# Altium project ST1-1.PrjPcb (part 4 of 5)

## Sheet Measurement.SchDoc: Measurement
size A3; DocumentNumber: 11; SheetNumber: 11; SheetTotal: 19
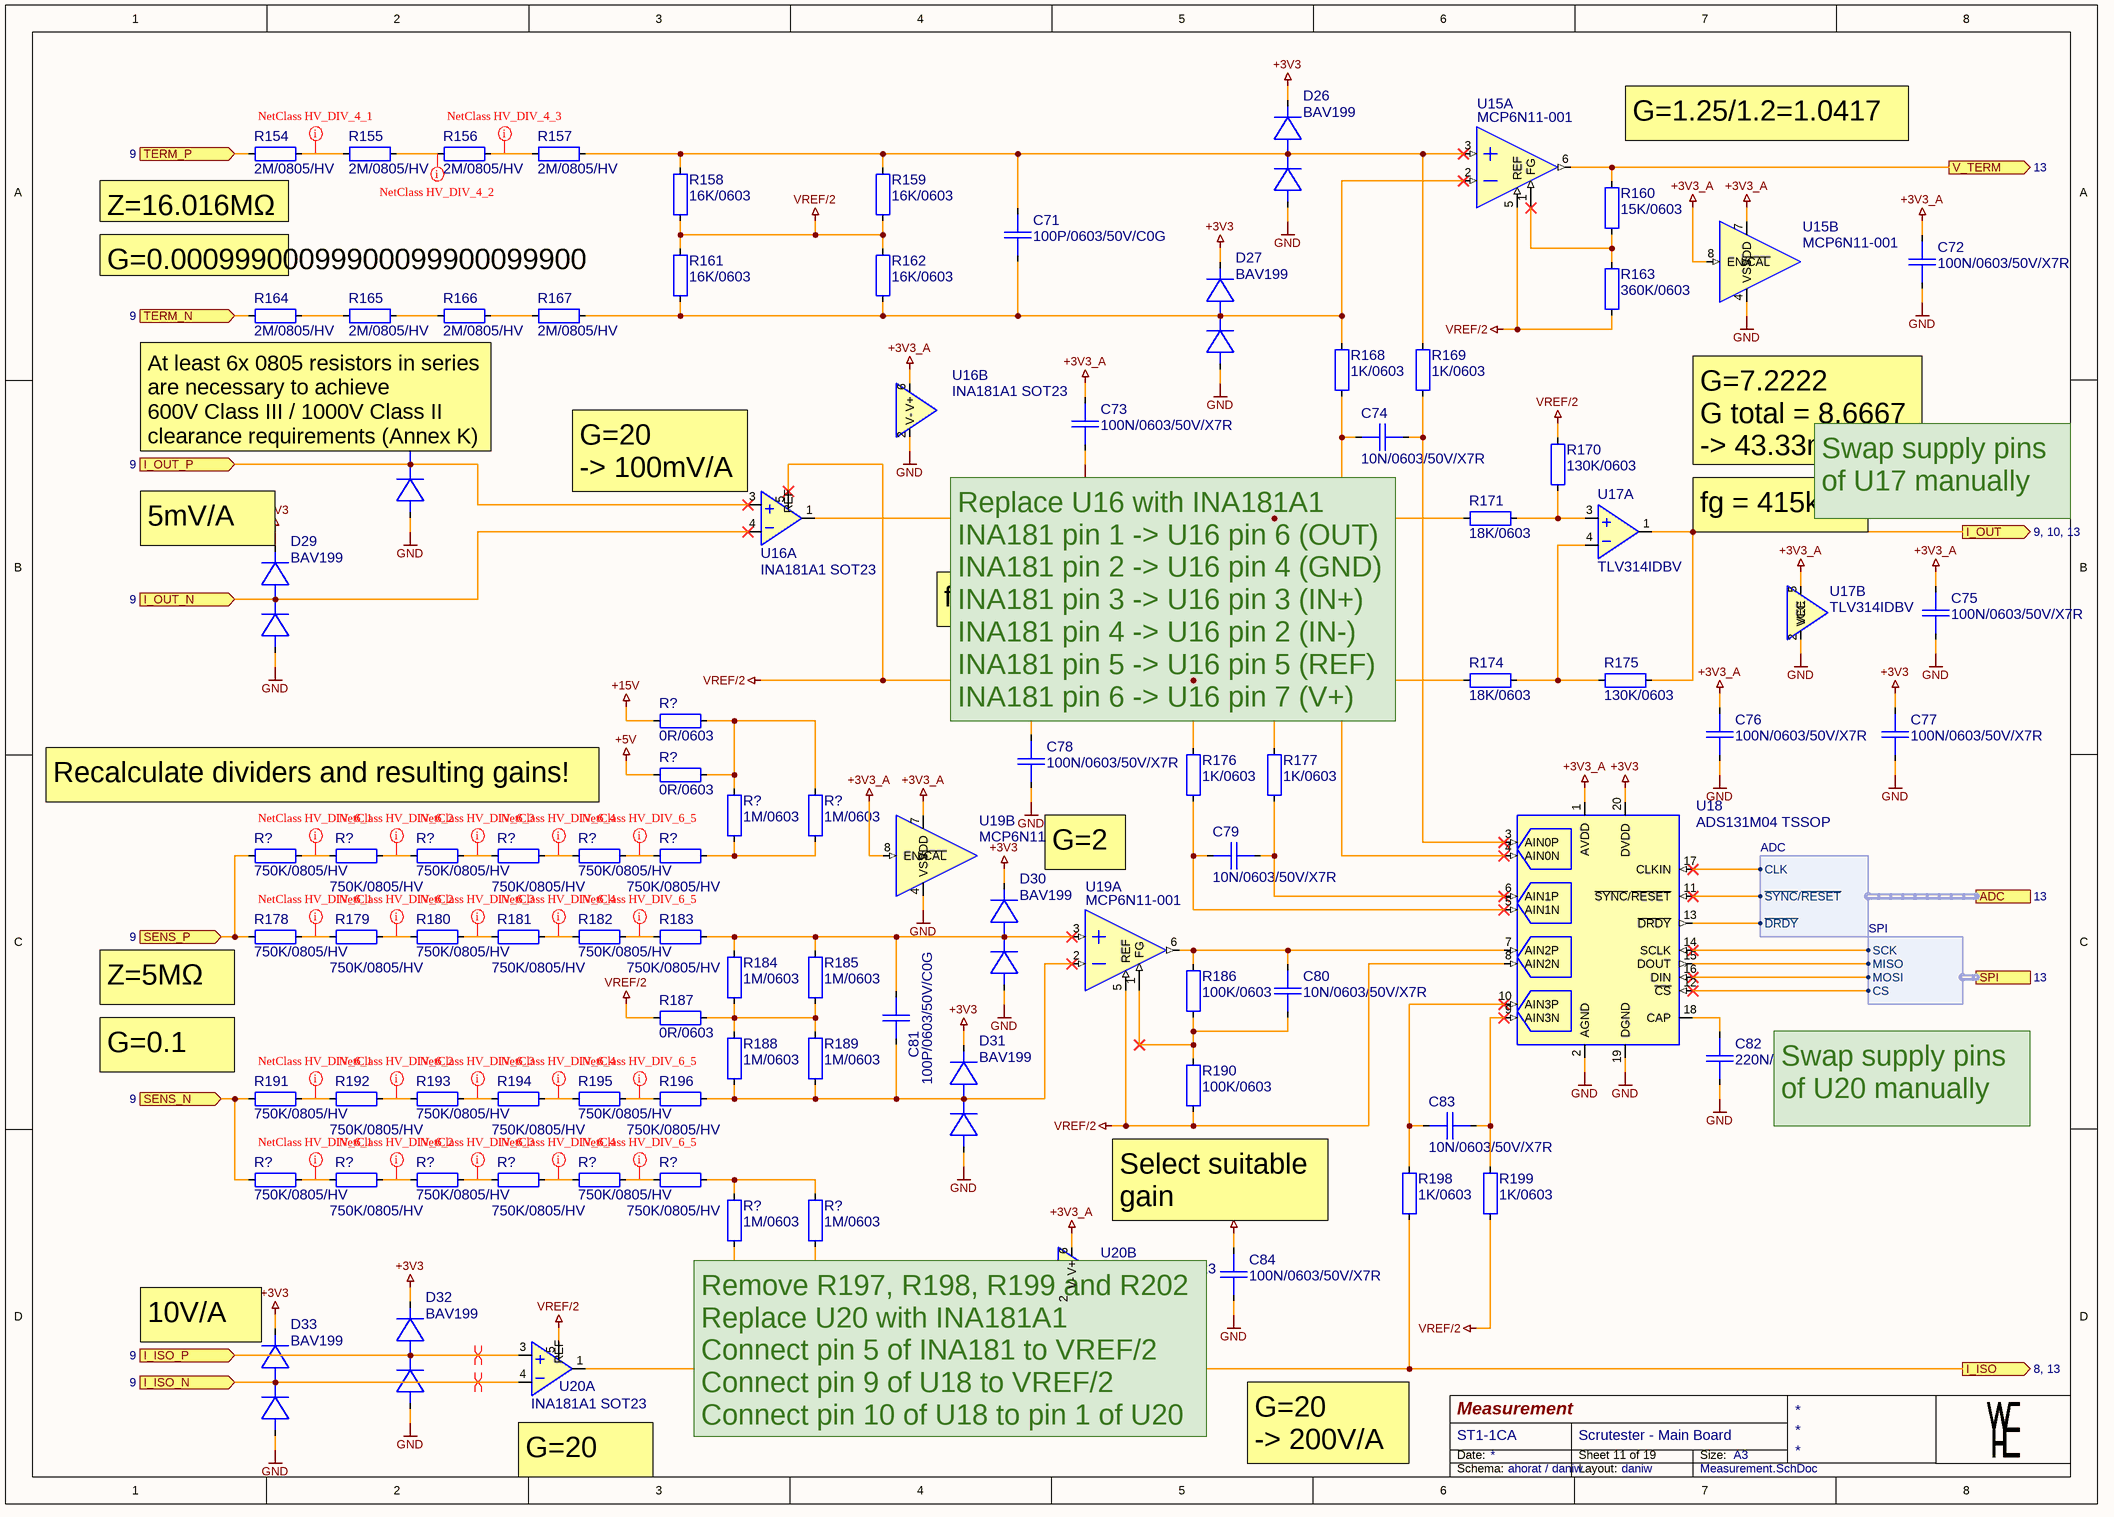
[diagram p8: Measurement.SchDoc]

### Parts
(Parts that share a designator on the sheet are numbered #1, #2 ... from top to bottom, then left to right.)
C71  100P/0603/50V/C0G  [CAP0603_C0G]
C72  100N/0603/50V/X7R  [CAP0603_X7R]
C73  100N/0603/50V/X7R  [CAP0603_X7R]
C74  10N/0603/50V/X7R  [CAP0603_X7R]
C75  100N/0603/50V/X7R  [CAP0603_X7R]
C76  100N/0603/50V/X7R  [CAP0603_X7R]
C77  100N/0603/50V/X7R  [CAP0603_X7R]
C78  100N/0603/50V/X7R  [CAP0603_X7R]
C79  10N/0603/50V/X7R  [CAP0603_X7R]
C80  10N/0603/50V/X7R  [CAP0603_X7R]
C81  100P/0603/50V/C0G  [CAP0603_C0G]
C82  220N/0603/25V/X7R  [CAP0603_X7R]
C83  10N/0603/50V/X7R  [CAP0603_X7R]
C84  100N/0603/50V/X7R  [CAP0603_X7R]
D26  BAV199  [SOT2395P280X125-3-SE]
D27  BAV199  [SOT2395P280X125-3-SE]
D28  BAV199  [SOT2395P280X125-3-SE]
D29  BAV199  [SOT2395P280X125-3-SE]
D30  BAV199  [SOT2395P280X125-3-SE]
D31  BAV199  [SOT2395P280X125-3-SE]
D32  BAV199  [SOT2395P280X125-3-SE]
D33  BAV199  [SOT2395P280X125-3-SE]
R154  2M/0805/HV  [R0805-0.50-HV-WW]
R155  2M/0805/HV  [R0805-0.50-HV-WW]
R156  2M/0805/HV  [R0805-0.50-HV-WW]
R157  2M/0805/HV  [R0805-0.50-HV-WW]
R158  16K/0603  [R0603-0.40-WW]
R159  16K/0603  [R0603-0.40-WW]
R160  15K/0603  [R0603-0.40-WW]
R161  16K/0603  [R0603-0.40-WW]
R162  16K/0603  [R0603-0.40-WW]
R163  360K/0603  [R0603-0.40-WW]
R164  2M/0805/HV  [R0805-0.50-HV-WW]
R165  2M/0805/HV  [R0805-0.50-HV-WW]
R166  2M/0805/HV  [R0805-0.50-HV-WW]
R167  2M/0805/HV  [R0805-0.50-HV-WW]
R168  1K/0603  [R0603-0.40-WW]
R169  1K/0603  [R0603-0.40-WW]
R170  130K/0603  [R0603-0.40-WW]
R171  18K/0603  [R0603-0.40-WW]
R174  18K/0603  [R0603-0.40-WW]
R175  130K/0603  [R0603-0.40-WW]
R176  1K/0603  [R0603-0.40-WW]
R177  1K/0603  [R0603-0.40-WW]
R178  750K/0805/HV  [R0805-0.50-HV-WW]
R179  750K/0805/HV  [R0805-0.50-HV-WW]
R180  750K/0805/HV  [R0805-0.50-HV-WW]
R181  750K/0805/HV  [R0805-0.50-HV-WW]
R182  750K/0805/HV  [R0805-0.50-HV-WW]
R183  750K/0805/HV  [R0805-0.50-HV-WW]
R184  1M/0603  [R0603-0.40-WW]
R185  1M/0603  [R0603-0.40-WW]
R186  100K/0603  [R0603-0.40-WW]
R187  0R/0603  [R0603-0.40-WW]
R188  1M/0603  [R0603-0.40-WW]
R189  1M/0603  [R0603-0.40-WW]
R190  100K/0603  [R0603-0.40-WW]
R191  750K/0805/HV  [R0805-0.50-HV-WW]
R192  750K/0805/HV  [R0805-0.50-HV-WW]
R193  750K/0805/HV  [R0805-0.50-HV-WW]
R194  750K/0805/HV  [R0805-0.50-HV-WW]
R195  750K/0805/HV  [R0805-0.50-HV-WW]
R196  750K/0805/HV  [R0805-0.50-HV-WW]
R198  1K/0603  [R0603-0.40-WW]
R199  1K/0603  [R0603-0.40-WW]
R?#11  0R/0603  [R0603-0.40-WW]
R?#12  0R/0603  [R0603-0.40-WW]
R?#13  1M/0603  [R0603-0.40-WW]
R?#14  1M/0603  [R0603-0.40-WW]
R?#15  750K/0805/HV  [R0805-0.50-HV-WW]
R?#16  750K/0805/HV  [R0805-0.50-HV-WW]
R?#17  750K/0805/HV  [R0805-0.50-HV-WW]
R?#18  750K/0805/HV  [R0805-0.50-HV-WW]
R?#19  750K/0805/HV  [R0805-0.50-HV-WW]
R?#20  750K/0805/HV  [R0805-0.50-HV-WW]
R?#21  750K/0805/HV  [R0805-0.50-HV-WW]
R?#22  750K/0805/HV  [R0805-0.50-HV-WW]
R?#23  750K/0805/HV  [R0805-0.50-HV-WW]
R?#24  750K/0805/HV  [R0805-0.50-HV-WW]
R?#25  750K/0805/HV  [R0805-0.50-HV-WW]
R?#26  750K/0805/HV  [R0805-0.50-HV-WW]
R?#27  1M/0603  [R0603-0.40-WW]
R?#28  1M/0603  [R0603-0.40-WW]
U15  MCP6N11-001  [SOP127P600X155-8-SW]  (parts A,B of 2)
U16  INA181A1 SOT23  [SOT2395P280X125-6-SE]  (parts A,B of 2)
U17  TLV314IDBV  [SOT2395P280X125-5-NW]  (parts A,B of 2)
U18  ADS131M04 TSSOP  [SOP065P640X120-20NW]
U19  MCP6N11-001  [SOP127P600X155-8-SW]  (parts A,B of 2)
U20  INA181A1 SOT23  [SOT2395P280X125-6-SE]  (parts A,B of 2)

### Ports
ADC (harness ADC, see 13), I_ISO (out, see 8, 13), I_ISO_N (in, see 9), I_ISO_P (in, see 9), I_OUT (out, see 9, 10, 13), I_OUT_N (in, see 9), I_OUT_P (in, see 9), SENS_N (in, see 9), SENS_P (in, see 9), SPI (harness SPI, see 13), TERM_N (in, see 9), TERM_P (in, see 9), V_TERM (out, see 13)

### Harnesses
ADC: CLK, ~{SYNC}/~{RESET}, ~{DRDY}
SPI: SCK, MISO, MOSI, CS

### Nets
+3V3: C77.1 D26.2(K2) D27.2(K2) D28.2(K2) D29.2(K2) D30.2(K2) D31.2(K2) D32.2(K2) D33.2(K2) U18.20(DVDD)
+3V3_A: C72.1 C73.1 C75.1 C76.1 C78.1 C84.1 U15.7(VDD) U15.8(EN/~{CAL}) U16.6(V+) U17.5(VCC) U18.1(AVDD) U19.7(VDD) U19.8(EN/~{CAL}) U20.6(V+)
+5V: R?#12.2
+15V: R?#11.2
GND: C72.2 C73.2 C75.2 C76.2 C77.2 C78.2 C82.2 C84.2 D26.1(A1) D27.1(A1) D28.1(A1) D29.1(A1) D30.1(A1) D31.1(A1) D32.1(A1) D33.1(A1) R?#27.2 R?#28.2 U15.4(VSS) U16.2(V-) U17.2(VEE) U18.2(AGND) U18.19(DGND) U19.4(VSS) U20.2(V-)
VREF/2: R158.2 R159.2 R161.1 R162.1 R163.2 R170.2 R174.1 R176.1 R187.2 R190.2 R199.2 U15.5(REF) U16.5(REF) U18.8(AIN2N) U19.5(REF) U20.5(REF)
ADC.CLK: U18.17(CLKIN) ; port ADC.CLK
ADC.~{DRDY}: U18.13(~{DRDY}) ; port ADC.~{DRDY}
ADC.~{SYNC}/~{RESET}: U18.11(~{SYNC}/~{RESET}) ; port ADC.~{SYNC}/~{RESET}
I_ISO: R198.2 U20.1(OUT) ; port I_ISO
I_ISO_N: D33.3(K1/A2) U20.4(IN-) ; port I_ISO_N
I_ISO_P: D32.3(K1/A2) U20.3(IN+) ; port I_ISO_P
I_OUT: R175.2 U17.1(OUT) ; port I_OUT
I_OUT_N: D29.3(K1/A2) U16.4(IN-) ; port I_OUT_N
I_OUT_P: D28.3(K1/A2) U16.3(IN+) ; port I_OUT_P
SENS_N: R191.1 R?#21.1 ; port SENS_N
SENS_P: R178.1 R?#15.1 ; port SENS_P
SPI.CS: U18.12(~{CS}) ; port SPI.CS
SPI.MISO: U18.15(DOUT) ; port SPI.MISO
SPI.MOSI: U18.16(DIN) ; port SPI.MOSI
SPI.SCK: U18.14(SCLK) ; port SPI.SCK
TERM_N: R164.1 ; port TERM_N
TERM_P: R154.1 ; port TERM_P
V_TERM: R160.1 U15.6(Out) ; port V_TERM
NetC71_1: C71.1 D26.3(K1/A2) R157.1 R158.1 R159.1 R169.1 U15.3(+)
NetC71_2: C71.2 D27.3(K1/A2) R161.2 R162.2 R167.2 R168.1 U15.2(-)
NetC74_1: C74.1 R168.2 U18.4(AIN0N)
NetC74_2: C74.2 R169.2 U18.3(AIN0P)
NetC79_1: C79.1 R176.2 U18.5(AIN1N)
NetC79_2: C79.2 R177.2 U18.6(AIN1P)
NetC80_1: C80.1 R186.1 U18.7(AIN2P) U19.6(Out)
NetC80_2: C80.2 R186.2 R190.1 U19.1(FG)
NetC81_1: C81.1 D30.3(K1/A2) R183.2 R184.1 R185.1 U19.3(+)
NetC81_2: C81.2 D31.3(K1/A2) R188.2 R189.2 R196.2 U19.2(-)
NetC82_1: C82.1 U18.18(CAP)
NetC83_1: C83.1 R198.1 U18.10(AIN3P)
NetC83_2: C83.2 R199.1 U18.9(AIN3N)
NetR154_2: R154.2 R155.2
NetR155_1: R155.1 R156.1
NetR156_2: R156.2 R157.2
NetR160_2: R160.2 R163.1 U15.1(FG)
NetR164_2: R164.2 R165.1
NetR165_2: R165.2 R166.1
NetR166_2: R166.2 R167.1
NetR170_1: R170.1 R171.2 U17.3(IN+)
NetR171_1: R171.1 R177.1 U16.1(OUT)
NetR174_2: R174.2 R175.1 U17.4(IN-)
NetR178_2: R178.2 R179.1
NetR179_2: R179.2 R180.1
NetR180_2: R180.2 R181.1
NetR181_2: R181.2 R182.1
NetR182_2: R182.2 R183.1
NetR184_2: R184.2 R185.2 R187.1 R188.1 R189.1
NetR191_2: R191.2 R192.1
NetR192_2: R192.2 R193.1
NetR193_2: R193.2 R194.1
NetR194_2: R194.2 R195.1
NetR195_2: R195.2 R196.1
NetR?#11_1: R?#11.1 R?#12.1 R?#13.1 R?#14.1
NetR?#13_2: R?#13.2 R?#14.2 R?#20.2
NetR?#15_2: R?#15.2 R?#16.1
NetR?#16_2: R?#16.2 R?#17.1
NetR?#17_2: R?#17.2 R?#18.1
NetR?#18_2: R?#18.2 R?#19.1
NetR?#19_2: R?#19.2 R?#20.1
NetR?#21_2: R?#21.2 R?#22.1
NetR?#22_2: R?#22.2 R?#23.1
NetR?#23_2: R?#23.2 R?#24.1
NetR?#24_2: R?#24.2 R?#25.1
NetR?#25_2: R?#25.2 R?#26.1
NetR?#26_2: R?#26.2 R?#27.1 R?#28.1

### Layout directives
net class HV_DIV_4_1: NetR154_2
net class HV_DIV_4_2: NetR155_1
net class HV_DIV_4_3: NetR156_2
net class HV_DIV_6_1: NetR178_2, NetR191_2, NetR?#15_2, NetR?#21_2
net class HV_DIV_6_2: NetR179_2, NetR192_2, NetR?#16_2, NetR?#22_2
net class HV_DIV_6_3: NetR180_2, NetR193_2, NetR?#17_2, NetR?#23_2
differential pair: I_ISO_N, I_ISO_P
net class HV_DIV_6_4: NetR181_2, NetR194_2, NetR?#18_2, NetR?#24_2
net class HV_DIV_6_5: NetR182_2, NetR195_2, NetR?#19_2, NetR?#25_2

### Notes on the sheet
- G=1.25/1.2=1.0417
- (near R154) Z=16.016MΩ
- (near R164) G=0.00099900099900099900099900
- (near D28) At least 6x 0805 resistors in series are necessary to achieve
  600V Class III / 1000V Class II clearance requirements (Annex K)
- (near U16) G=20
  -> 100mV/A
- G=7.2222
  G total = 8.6667
  -> 43.33mV/A
- Swap supply pins of U17 manually
- (near D29) 5mV/A
- fg = 415kHz
- fg = 417kHz
- Replace U16 with INA181A1
  INA181 pin 1 -> U16 pin 6 (OUT)
  INA181 pin 2 -> U16 pin 4 (GND)
  INA181 pin 3 -> U16 pin 3 (IN+)
  INA181 pin 4 -> U16 pin 2 (IN-)
  INA181 pin 5 -> U16 pin 5 (REF)
  INA181 pin 6 -> U16 pin 7 (V+)
- Recalculate dividers and resulting gains!
- G=2
- (near R178) Z=5MΩ
- (near R191) G=0.1
- Swap supply pins of U20 manually
- Select suitable gain
- (near D33) 10V/A
- (near U20) Remove R197, R198, R199 and R202
  Replace U20 with INA181A1
  Connect pin 5 of INA181 to VREF/2
  Connect pin 9 of U18 to VREF/2
  Connect pin 10 of U18 to pin 1 of U20
- G=20
  -> 200V/A
- (near U20) G=20
- Date:
- Size:
- A3
- Schema:
- Layout:

### Library data of the parts
C71 C81 = 100P/0603/50V/C0G: CAP SM 0603 100pF 50V C0G; Manufacturer: GENERIC; Manufacturer 1: YAGEO; Manufacturer Part Number 1: CC0603JRNPO9BN101; Absolute Value: 1E-10; Eurocircuits GPN: GPC0603101-C0G; Part Number: 100P/0603/50V/C0G; Package: 0603; Value: 100pF; HelpURL: https://www.yageo.com/upload/media/product/productsearch/datasheet/mlcc/UPY-GP_NP0_16V-to-50V_18.pdf; Supplier 1: Digi-Key; Supplier Part Number 1: 311-1069-1-ND; Manufacturer 2: YAGEO; Manufacturer Part Number 2: CC0603KRNPO9BN101; Supplier 2: Digi-Key; Supplier Part Number 2: 311-3600-1-ND; JLC Type: Basic; Manufacturer Part Number 3: CL10C101JB8NNNC; Supplier 3: LCSC; Supplier Part Number 3: C14858
C72 C73 C75-C78 C84 = 100N/0603/50V/X7R: CAP SM 0603 100nF 50V X7R; Manufacturer: GENERIC; Manufacturer 1: YAGEO; Manufacturer Part Number 1: CC0603KPX7R9BB104; Absolute Value: 1E-7; Eurocircuits GPN: GPC0603104; Part Number: 100N/0603/50V/X7R; Package: 0603; Value: 100nF; HelpURL: https://www.yageo.com/upload/media/product/app/datasheet/mlcc/upy-gphc_x7r_6_3v-to-250v.pdf; Supplier 1: Digi-Key; Supplier Part Number 1: 311-3567-1-ND; Supplier 3: LCSC; Supplier Part Number 3: C14663; Manufacturer 2: YAGEO; Manufacturer Part Number 2: CC0603MRX7R9BB104; Supplier 2: Digi-Key; Supplier Part Number 2: 311-4110-1-ND; JLC Type: Basic; Manufacturer Part Number 3: CC0603KRX7R9BB104
C74 C79 C80 C83 = 10N/0603/50V/X7R: CAP SM 0603 10nF 50V X7R; Manufacturer: GENERIC; Manufacturer 1: YAGEO; Manufacturer Part Number 1: CC0603KPX7R9BB103; Absolute Value: 1E-8; Eurocircuits GPN: GPC0603103; Part Number: 10N/0603/50V/X7R; Package: 0603; Value: 10nF; HelpURL: https://www.yageo.com/upload/media/product/app/datasheet/mlcc/upy-gphc_x7r_6_3v-to-250v.pdf; Supplier 1: Digi-Key; Supplier Part Number 1: 311-1572-1-ND; Manufacturer 2: YAGEO; Manufacturer Part Number 2: CC0603KRX7R9BB103; Supplier 2: Digi-Key; Supplier Part Number 2: 311-1085-1-ND; Manufacturer Part Number 3: CC0603KRX7R9BB103; Supplier 3: LCSC; Supplier Part Number 3: C100042
C82 = 220N/0603/25V/X7R: CAP SM 0603 220nF 25V X7R; Manufacturer: GENERIC; Absolute Value: 2.2E-7; Eurocircuits GPN: GPC0603; Part Number: 220N/0603/25V/X7R; Package: 0603; Value: 220nF; Supplier 3: LCSC; Supplier Part Number 3: C21120; JLC Type: Basic; Manufacturer Part Number 3: CL10B224KA8NNNC
D26-D33 = BAV199: as D22-D25 on sheet Current_Controller; Part Number: BAV199; Package: SOT23; Value: BAV199; Absolute Value: 85V; HelpURL: https://www.infineon.com/dgdl/bav199series.pdf?folderId=db3a30431400ef6801141c748874044e&fileId=db3a30431400ef6801141cba733104e5; Manufacturer 1: Infineon Technologies; Supplier 1: Digikey; Supplier Part Number 1: BAV199E6433HTMA1CT-ND; Manufacturer 3: LRC; Manufacturer Part Number 3: LBAV199LT1G; Supplier 3: LCSC; Supplier Part Number 3: C12740
R154-R157 R164-R167 = 2M/0805/HV: RES SM 0805 2M High voltage; Manufacturer: GENERIC; Manufacturer 1: YAGEO; Manufacturer Part Number 1: RV0805FR-072ML; Absolute Value: 2000000; Part Number: 2M/0805/HV; Package: 0805; Value: 2M; HelpURL: https://www.yageogroup.com/content/datasheet/asset/file/PYU-RV_51_ROHS_L; Supplier 1: Digi-Key; Supplier Part Number 1: 13-RV0805FR-072MLCT-ND; Manufacturer 3: YAGEO; Manufacturer Part Number 3: RV0805FR-072ML; Supplier 3: LCSC; Supplier Part Number 3: C873372; JLC Type: Extended
R158 R159 R161 R162 = 16K/0603: RES SM 0603 16K; Manufacturer: GENERIC; Manufacturer 1: YAGEO; Manufacturer Part Number 1: RC0603FR-1316KL; Absolute Value: 16000; Eurocircuits GPN: GPR060316K; Part Number: 16K/0603; Package: 0603; Value: 16K; HelpURL: https://www.yageogroup.com/content/datasheet/asset/file/PYU-RC_GROUP_51_ROHS_L; Supplier 1: Digi-Key; Supplier Part Number 1: 13-RC0603FR-1316KLCT-ND; Manufacturer 2: YAGEO; Manufacturer Part Number 2: RC0603FR-1016KL; Supplier 2: Digi-Key; Supplier Part Number 2: 13-RC0603FR-1016KLCT-ND; JLC Type: Extended; Manufacturer 3: YAGEO; Manufacturer Part Number 3: RC0603FR-0716KL; Supplier 3: LCSC; Supplier Part Number 3: C137788
R160 = 15K/0603: RES SM 0603 15K; Manufacturer: GENERIC; Manufacturer 1: YAGEO; Manufacturer Part Number 1: RC0603FR-1315KL; Absolute Value: 15000; Eurocircuits GPN: GPR060315K; Part Number: 15K/0603; Package: 0603; Value: 15K; HelpURL: https://www.yageogroup.com/content/datasheet/asset/file/PYU-RC_GROUP_51_ROHS_L; Supplier 1: Digi-Key; Supplier Part Number 1: 13-RC0603FR-1315KLCT-ND; Manufacturer 2: YAGEO; Manufacturer Part Number 2: RC0603FR-1015KL; Supplier 2: Digi-Key; Supplier Part Number 2: 13-RC0603FR-1015KLCT-ND; Manufacturer 3: UNI-ROYAL(Uniroyal Elec); Manufacturer Part Number 3: 0603WAF1502T5E; Supplier 3: LCSC; Supplier Part Number 3: C22809; JLC Type: Basic
R163 = 360K/0603: RES SM 0603 360K; Manufacturer: GENERIC; Manufacturer 1: YAGEO; Manufacturer Part Number 1: RC0603FR-07360KL; Absolute Value: 360000; Eurocircuits GPN: GPR0603360K; Part Number: 360K/0603; Package: 0603; Value: 360K; HelpURL: https://www.yageogroup.com/content/datasheet/asset/file/PYU-RC_GROUP_51_ROHS_L; Supplier 1: Digi-Key; Supplier Part Number 1: 311-360KHRCT-ND; JLC Type: Extended; Manufacturer 3: UNI-ROYAL(Uniroyal Elec); Manufacturer Part Number 3: 0603WAF3603T5E; Supplier 3: LCSC; Supplier Part Number 3: C23146
R168 R169 R176 R177 R198 R199 = 1K/0603: RES SM 0603 1K; Manufacturer: GENERIC; Manufacturer 1: YAGEO; Manufacturer Part Number 1: RC0603FR-131KL; Absolute Value: 1000; Eurocircuits GPN: GPR06031K; Part Number: 1K/0603; Package: 0603; Value: 1K; HelpURL: https://www.yageogroup.com/content/datasheet/asset/file/PYU-RC_GROUP_51_ROHS_L; Supplier 1: Digi-Key; Supplier Part Number 1: 13-RC0603FR-131KLCT-ND; Manufacturer 2: YAGEO; Manufacturer Part Number 2: RC0603FR-101KL; Supplier 2: Digi-Key; Supplier Part Number 2: 13-RC0603FR-101KLCT-ND; Manufacturer 3: UNI-ROYAL(Uniroyal Elec); Manufacturer Part Number 3: 0603WAF1001T5E; Supplier 3: LCSC; Supplier Part Number 3: C21190; JLC Type: Basic
R170 R175 = 130K/0603: RES SM 0603 130K; Manufacturer: GENERIC; Manufacturer 1: YAGEO; Manufacturer Part Number 1: RC0603FR-07130KL; Absolute Value: 130000; Eurocircuits GPN: GPR0603130K; Part Number: 130K/0603; Package: 0603; Value: 130K; HelpURL: https://www.yageogroup.com/content/datasheet/asset/file/PYU-RC_GROUP_51_ROHS_L; Supplier 1: Digi-Key; Supplier Part Number 1: 311-130KHRCT-ND; JLC Type: Extended; Manufacturer 3: YAGEO; Manufacturer Part Number 3: RC0603FR-07130KL; Supplier 3: LCSC; Supplier Part Number 3: C163432
R171 R174 = 18K/0603: RES SM 0603 18K; Manufacturer: GENERIC; Manufacturer 1: YAGEO; Manufacturer Part Number 1: RC0603FR-1318KL; Absolute Value: 18000; Eurocircuits GPN: GPR060318K; Part Number: 18K/0603; Package: 0603; Value: 18K; HelpURL: https://www.yageogroup.com/content/datasheet/asset/file/PYU-RC_GROUP_51_ROHS_L; Supplier 1: Digi-Key; Supplier Part Number 1: 13-RC0603FR-1318KLCT-ND; Manufacturer 2: YAGEO; Manufacturer Part Number 2: RC0603FR-1018KL; Supplier 2: Digi-Key; Supplier Part Number 2: 13-RC0603FR-1018KLCT-ND; JLC Type: Basic; Manufacturer 3: UNI-ROYAL; Manufacturer Part Number 3: 0603WAF1802T5E; Supplier 3: LCSC; Supplier Part Number 3: C25810
R178-R183 R191-R196 R?#15-R?#26 = 750K/0805/HV: RES SM 0805 750K High voltage; Manufacturer: GENERIC; Manufacturer 1: YAGEO; Absolute Value: 750000; Part Number: 750K/0805/HV; Package: 0805; Value: 750K; HelpURL: https://www.yageogroup.com/content/datasheet/asset/file/PYU-RV_51_ROHS_L; Manufacturer 3: YAGEO; Manufacturer Part Number 3: RV0805FR-07750KL; Supplier 3: LCSC; Supplier Part Number 3: C873432; JLC Type: Extended
R184 R185 R188 R189 R?#13 R?#14 R?#27 R?#28 = 1M/0603: RES SM 0603 1M; Manufacturer: GENERIC; Manufacturer 1: YAGEO; Manufacturer Part Number 1: RC0603FR-131ML; Absolute Value: 1000000; Eurocircuits GPN: GPR06031M; Part Number: 1M/0603; Package: 0603; Value: 1M; HelpURL: https://www.yageogroup.com/content/datasheet/asset/file/PYU-RC_GROUP_51_ROHS_L; Supplier 1: Digi-Key; Supplier Part Number 1: 13-RC0603FR-131MLCT-ND; Manufacturer 2: YAGEO; Manufacturer Part Number 2: RC0603FR-101ML; Supplier 2: Digi-Key; Supplier Part Number 2: 13-RC0603FR-101MLCT-ND; JLC Type: Basic; Manufacturer 3: UNI-ROYAL(Uniroyal Elec); Manufacturer Part Number 3: 0603WAF1004T5E; Supplier 3: LCSC; Supplier Part Number 3: C22935
R186 R190 = 100K/0603: RES SM 0603 100K; Manufacturer: GENERIC; Manufacturer 1: YAGEO; Manufacturer Part Number 1: RC0603FR-13100KL; Absolute Value: 100000; Eurocircuits GPN: GPR0603100K; Part Number: 100K/0603; Package: 0603; Value: 100K; HelpURL: https://www.yageogroup.com/content/datasheet/asset/file/PYU-RC_GROUP_51_ROHS_L; Supplier 1: Digi-Key; Supplier Part Number 1: 13-RC0603FR-13100KLCT-ND; Manufacturer 2: YAGEO; Manufacturer Part Number 2: RC0603FR-10100KL; Supplier 2: Digi-Key; Supplier Part Number 2: 13-RC0603FR-10100KLCT-ND; JLC Type: Basic; Manufacturer 3: UNI-ROYAL(Uniroyal Elec); Manufacturer Part Number 3: 0603WAF1003T5E; Supplier 3: LCSC; Supplier Part Number 3: C25803
R187 R?#11 R?#12 = 0R/0603: as R?#4-R?#7 on sheet Output_Terminals; Part Number: 0R/0603; Package: 0603; Value: 0R; HelpURL: https://www.yageogroup.com/content/datasheet/asset/file/PYU-RC_GROUP_51_ROHS_L; Supplier 1: Digi-Key; Supplier Part Number 1: 311-0.0HRCT-ND; Manufacturer 2: YAGEO; Manufacturer Part Number 2: RC0603FR-130RL; Supplier 2: Digi-Key; Supplier Part Number 2: 13-RC0603FR-130RLCT-ND; Manufacturer 3: UNI-ROYAL(Uniroyal Elec); Manufacturer Part Number 3: 0603WAF0000T5E; Supplier 3: LCSC; Supplier Part Number 3: C21189; JLC Type: Basic
U15 U19 = MCP6N11-001 SO-8: MCP6N11-001 500 kHz, 800 μA Instrumentation Amplifier SO-8; Manufacturer: Microchip Technology; Manufacturer Part Number 1: MCP6N11-001E/SN; Part Number: MCP6N11-001 SO-8; Package: SO-8; HelpURL: https://ww1.microchip.com/downloads/en/DeviceDoc/25073A.pdf; Manufacturer 1: Microchip Technology; Supplier 1: Digi-Key; Supplier Part Number 1: MCP6N11-001E/SN-ND; Manufacturer 2: Microchip Technology; Manufacturer Part Number 2: MCP6N11T-001E/SN; Supplier 2: Digi-Key; Supplier Part Number 2: MCP6N11T-001E/SN-ND; Manufacturer 3: Microchip Tech; Manufacturer Part Number 3: MCP6N11T-001E/SN; Supplier 3: LCSC; Supplier Part Number 3: C623787
U16 U20 = INA181A1 SOT23: INA181A1, Bidirectional, Low- and High-Side Voltage Output, Current-Sense Amplifier, 20 V/V, SOT23; Manufacturer: Texas Instruments; Manufacturer Part Number 1: INA181A1IDBVR; Part Number: INA181A1 SOT23; Package: SOT23-6; HelpURL: https://www.ti.com/lit/ds/symlink/ina181.pdf; Manufacturer 1: Texas Instruments; Supplier 1: Digi-Key; Supplier Part Number 1: 296-47656-1-ND; Manufacturer 2: Texas Instruments; Manufacturer Part Number 2: INA181A1IDBVT; Supplier 2: Digi-Key; Supplier Part Number 2: 296-46634-1-ND; Manufacturer 3: Texas Instruments; Manufacturer Part Number 3: INA181A1IDBVR; Supplier 3: LCSC; Supplier Part Number 3: C2058943; Manufacturer 4: Texas Instruments; Manufacturer Part Number 4: INA181A1IDBVT; Supplier 4: LCSC; Supplier Part Number 4: C2861997; JLC Type: Extended
U17 = TLV314 SOT23: TLV314, 3-MHz, Low-Power, Internal EMI Filter, RRIO, Operational Amplifier; Manufacturer: Texas Instruments; Manufacturer Part Number 1: TLV314IDBVR; Part Number: TLV314 SOT23; Package: SOT23-5; HelpURL: https://www.ti.com/lit/ds/symlink/tlv4314.pdf; Manufacturer 1: Texas Instruments; Supplier 1: Digi-Key; Supplier Part Number 1: 296-46275-1-ND; Manufacturer 3: Texas Instruments; Manufacturer Part Number 3: TLV314IDBVR; Supplier 3: LCSC; Supplier Part Number 3: C133032; Manufacturer 2: Texas Instruments; Manufacturer Part Number 2: TLV314IDBVT; Supplier 2: Digi-Key; Supplier Part Number 2: 296-44110-2-ND
U18 = ADS131M04 TSSOP: ADS131M04 4-Channel, Simultaneously-Sampling, 24-Bit, Delta-Sigma ADC; Manufacturer: Texas Instruments; Manufacturer Part Number 1: ADS131M04IPWR; Part Number: ADS131M04 TSSOP; Package: TSSOP-20; HelpURL: https://www.ti.com/lit/ds/symlink/ads131m04.pdf; Manufacturer 1: Texas Instruments; Manufacturer 2: Texas Instruments; Manufacturer Part Number 2: ADS131M04IPWT; Supplier 1: Digi-Key; Supplier 2: Digi-Key; Supplier Part Number 1: 296-ADS131M04IPWRCT-ND; Supplier Part Number 2: 296-ADS131M04IPWTCT-ND; Manufacturer 3: Texas Instruments; Manufacturer Part Number 3: ADS131M04IPWR; Supplier 3: LCSC; Supplier Part Number 3: C2862562

## Sheet Overvoltage_Protection.SchDoc: Overvoltage Protection
size A3; DocumentNumber: 7; SheetNumber: 7; SheetTotal: 20
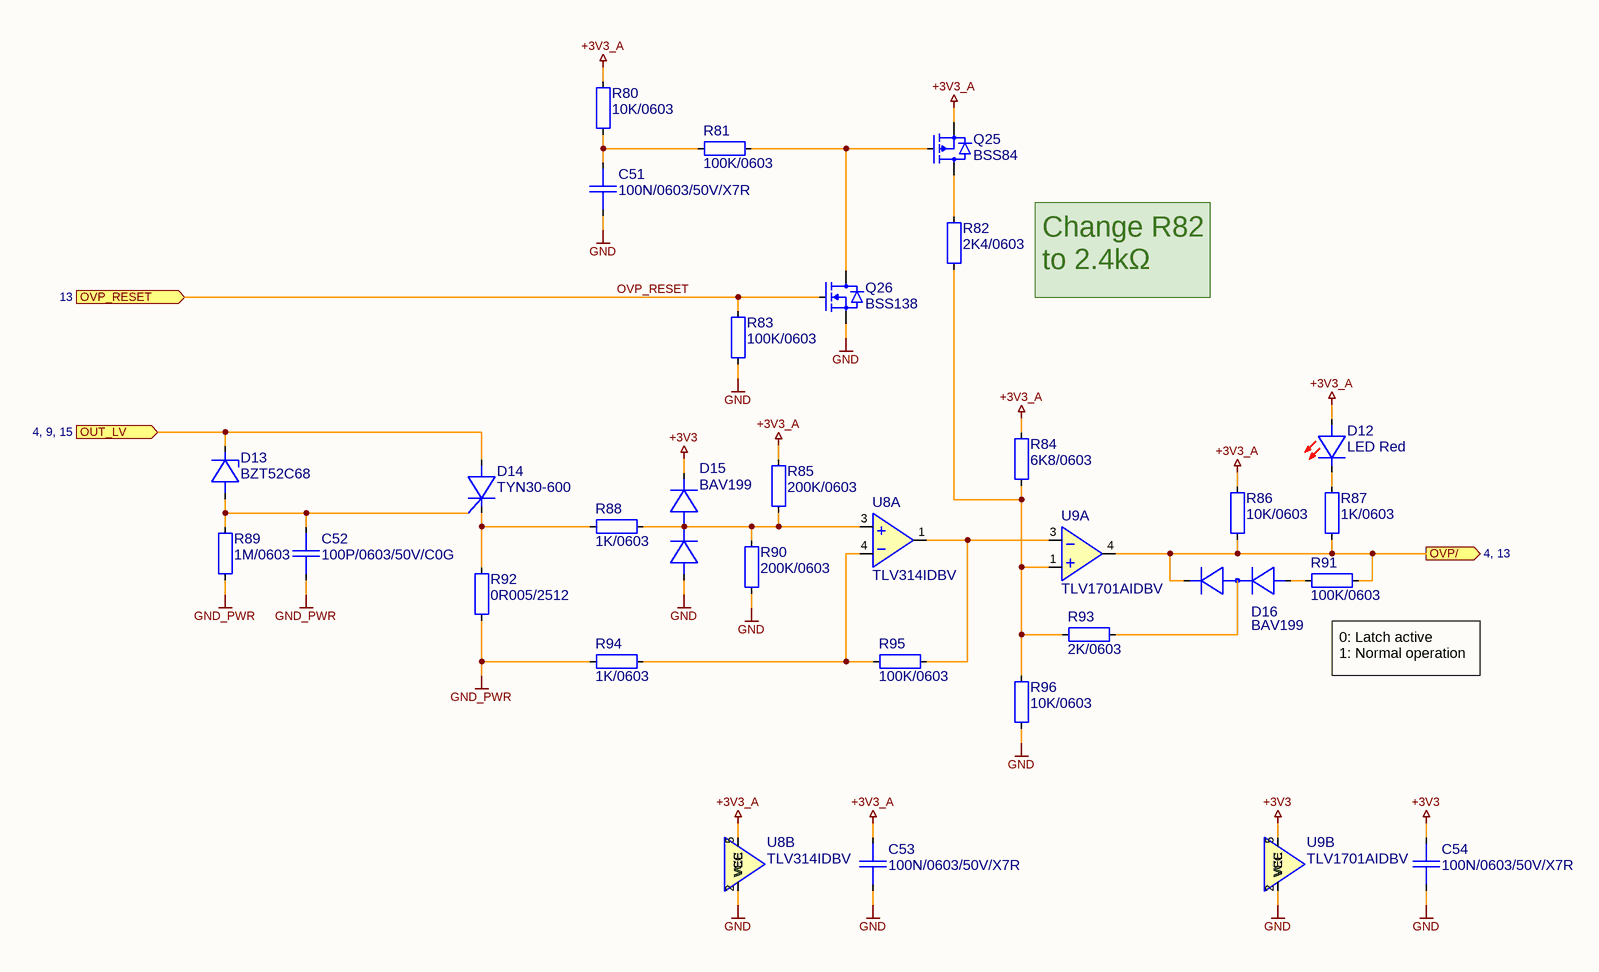
[diagram p9: Overvoltage_Protection.SchDoc]

### Parts
C51  100N/0603/50V/X7R  [CAP0603_X7R]
C52  100P/0603/50V/C0G  [CAP0603_C0G]
C53  100N/0603/50V/X7R  [CAP0603_X7R]
C54  100N/0603/50V/X7R  [CAP0603_X7R]
D12  LED Red  [LED0805_RED]
D13  BZT52C68  [SOD3718X125]
D14  TYN30-600  [TO220-3]
D15  BAV199  [SOT2395P280X125-3-SE]
D16  BAV199  [SOT2395P280X125-3-SE]
Q25  BSS84  [SOT2395P280X125-3-SE]
Q26  BSS138  [SOT2395P280X125-3-SE]
R80  10K/0603  [R0603-0.40-WW]
R81  100K/0603  [R0603-0.40-WW]
R82  2K4/0603  [R0603-0.40-WW]
R83  100K/0603  [R0603-0.40-WW]
R84  6K8/0603  [R0603-0.40-WW]
R85  200K/0603  [R0603-0.40-WW]
R86  10K/0603  [R0603-0.40-WW]
R87  1K/0603  [R0603-0.40-WW]
R88  1K/0603  [R0603-0.40-WW]
R89  1M/0603  [R0603-0.40-WW]
R90  200K/0603  [R0603-0.40-WW]
R91  100K/0603  [R0603-0.40-WW]
R92  0R005/2512  [R2512-0.65-WW]
R93  2K/0603  [R0603-0.40-WW]
R94  1K/0603  [R0603-0.40-WW]
R95  100K/0603  [R0603-0.40-WW]
R96  10K/0603  [R0603-0.40-WW]
U8  TLV314IDBV  [SOT2395P280X125-5-NW]  (parts A,B of 2)
U9  TLV1701AIDBV  [SOT2395P280X125-5-NW]  (parts A,B of 2)

### Ports
OUT_LV (in, see 4, 9, 15), OVP/ (out, see 4, 13), OVP_RESET (in, see 13)

### Nets
+3V3: C54.1 D15.2(K2) U9.5(VCC)
+3V3_A: C53.1 D12.2(A) Q25.2(SOURCE) R80.1 R84.1 R85.1 R86.2 U8.5(VCC)
GND: C51.2 C53.2 C54.2 D15.1(A1) Q26.2(SOURCE) R83.2 R90.2 R96.2 U8.2(VEE) U9.2(VEE)
GND_PWR: C52.2 R89.2 R92.2 R94.2
OUT_LV: D13.1(C) D14.2(A) ; port OUT_LV
OVP/: D16.2(K2) R86.1 R87.1 R91.2 U9.4(OUT) ; port OVP/
OVP_RESET: Q26.1(GATE) R83.1 ; port OVP_RESET
NetC51_1: C51.1 R80.2 R81.1
NetC52_1: C52.1 D13.2(A) D14.3(G) R89.1
NetD12_1: D12.1(C) R87.2
NetD14_1: D14.1(C) R88.1 R92.1
NetD15_3: D15.3(K1/A2) R85.2 R88.2 R90.1 U8.3(IN+)
NetD16_1: D16.1(A1) R91.1
NetD16_3: D16.3(K1/A2) R93.2
NetQ25_1: Q25.1(GATE) Q26.3(DRAIN) R81.2
NetQ25_3: Q25.3(DRAIN) R82.1
NetR82_2: R82.2 R84.2 R93.1 R96.1 U9.1(IN+)
NetR94_1: R94.1 R95.2 U8.4(IN-)
NetR95_1: R95.1 U8.1(OUT) U9.3(IN-)

### Notes on the sheet
- Change R82 to 2.4kΩ
- 0: Latch active
  1: Normal operation
- Date:
- Size:
- A3
- Schema:
- Layout:

### Library data of the parts
C51 C53 C54 = 100N/0603/50V/X7R: as C72 on sheet Measurement; Part Number: 100N/0603/50V/X7R; Package: 0603; Value: 100nF; HelpURL: https://www.yageo.com/upload/media/product/app/datasheet/mlcc/upy-gphc_x7r_6_3v-to-250v.pdf; Supplier 1: Digi-Key; Supplier Part Number 1: 311-3567-1-ND; Supplier 3: LCSC; Supplier Part Number 3: C14663; Manufacturer 2: YAGEO; Manufacturer Part Number 2: CC0603MRX7R9BB104; Supplier 2: Digi-Key; Supplier Part Number 2: 311-4110-1-ND; JLC Type: Basic; Manufacturer Part Number 3: CC0603KRX7R9BB104
C52 = 100P/0603/50V/C0G: as C71 on sheet Measurement; Part Number: 100P/0603/50V/C0G; Package: 0603; Value: 100pF; HelpURL: https://www.yageo.com/upload/media/product/productsearch/datasheet/mlcc/UPY-GP_NP0_16V-to-50V_18.pdf; Supplier 1: Digi-Key; Supplier Part Number 1: 311-1069-1-ND; Manufacturer 2: YAGEO; Manufacturer Part Number 2: CC0603KRNPO9BN101; Supplier 2: Digi-Key; Supplier Part Number 2: 311-3600-1-ND; JLC Type: Basic; Manufacturer Part Number 3: CL10C101JB8NNNC; Supplier 3: LCSC; Supplier Part Number 3: C14858
D12 = LED Red 0805: Generic LED Red 0805; Manufacturer 1: Würth; Manufacturer Part Number 1: 150080RS75000; Part Number: LED Red 0805; Manufacturer: GENERIC; Package: 805; Value: Red; Absolute Value: Red; HelpURL: https://www.we-online.com/katalog/datasheet/150060RS75000.pdf; Supplier 1: Digikey; Supplier Part Number 1: 732-4984-1-ND; Manufacturer 3: Foshan NationStar Optoelectronics; Manufacturer Part Number 3: NCD0805R1; Supplier 3: LCSC; Supplier Part Number 3: C84256; JLC Type: Basic
D13 = BZT52C68: DIODE ZENER 68V 350MW SOD123; Manufacturer: Nexperia USA Inc.; Manufacturer Part Number 1: BZT52-C68J; Part Number: BZT52C68; Package: SOD-123; Value: BZT52C68; Absolute Value: 68 V; HelpURL: https://assets.nexperia.com/documents/data-sheet/BZT52_SER.pdf; Manufacturer 1: Nexperia USA Inc.; Supplier 1: Digikey; Supplier Part Number 1: 1727-8144-1-ND; Manufacturer 2: Panjit International Inc.; Manufacturer Part Number 2: BZT52-C68_R1_00001; Supplier 2: Digikey; Supplier Part Number 2: 3757-BZT52-C68_R1_00001CT-ND; JLC Type: Extended; Manufacturer 3: JUXING; Manufacturer Part Number 3: BZT52C68V; Supplier 3: LCSC; Supplier Part Number 3: C5365518
D14 = TYN30-600: Planar passivated Silicon Controlled Rectifier (SCR) in a TO220 plastic package, 600V, 30A; Manufacturer: WeEn Semiconductors; Value: TYN30-600TFQ; Part Number: TYN30-600; Package: TO-220; HelpURL: https://www.ween-semi.com/datasheet/TYN30-600TF.pdf; Manufacturer 1: WeEn Semiconductors; Manufacturer Part Number 1: TYN30-600TFQ; Supplier 1: Digikey; Supplier Part Number 1: 1740-TYN30-600TFQ-ND
D15 D16 = BAV199: as D22-D25 on sheet Current_Controller; Part Number: BAV199; Package: SOT23; Value: BAV199; Absolute Value: 85V; HelpURL: https://www.infineon.com/dgdl/bav199series.pdf?folderId=db3a30431400ef6801141c748874044e&fileId=db3a30431400ef6801141cba733104e5; Manufacturer 1: Infineon Technologies; Supplier 1: Digikey; Supplier Part Number 1: BAV199E6433HTMA1CT-ND; Manufacturer 3: LRC; Manufacturer Part Number 3: LBAV199LT1G; Supplier 3: LCSC; Supplier Part Number 3: C12740
Q25 = BSS84: 50V P-Channel MOSFET; Manufacturer: GENERIC; Manufacturer 1: Good-Ark Semiconductor; Part Number: BSS84; Package: SOT23; HelpURL: https://goodarksemi.com/docs/datasheets/mosfets/BSS84.pdf; Manufacturer Part Number 1: BSS84; Supplier 1: Digi-Key; Supplier Part Number 1: 4786-BSS84CT-ND; Manufacturer 3: Jiangsu Changjing Electronics Technology Co., Ltd.; Manufacturer Part Number 3: BSS84; Supplier 3: LCSC; Supplier Part Number 3: C114481; JLC Type: Extended; Manufacturer 2: LRC; Manufacturer Part Number 2: LBSS84LT1G; Supplier 2: LCSC; Supplier Part Number 2: C8492
Q26 = BSS138: N-Kanal 50 V 220mA (Ta) 350mW (Ta) Oberflächenmontage SOT-23; Manufacturer: GENERIC; Manufacturer 1: ANBON SEMICONDUCTOR (INT'L) LIMITED; Part Number: BSS138; Package: SOT23; HelpURL: https://mm.digikey.com/Volume0/opasdata/d220001/medias/docus/3037/BSS138.pdf; Manufacturer Part Number 1: BSS138; Supplier 1: Digi-Key; Supplier Part Number 1: 4530-BSS138CT-ND; Manufacturer 3: FOSAN; Manufacturer Part Number 3: BSS138; Supplier 3: LCSC; Supplier Part Number 3: C2926186; JLC Type: Extended; Manufacturer 2: FOSAN; Manufacturer Part Number 2: BSS138; Supplier 2: LCSC; Supplier Part Number 2: C2926186
R80 R86 R96 = 10K/0603: RES SM 0603 10K; Manufacturer: GENERIC; Manufacturer 1: YAGEO; Manufacturer Part Number 1: RC0603FR-1310KL; Absolute Value: 10000; Eurocircuits GPN: GPR060310K; Part Number: 10K/0603; Package: 0603; Value: 10K; HelpURL: https://www.yageogroup.com/content/datasheet/asset/file/PYU-RC_GROUP_51_ROHS_L; Supplier 1: Digi-Key; Supplier Part Number 1: 13-RC0603FR-1310KLCT-ND; Manufacturer 2: YAGEO; Manufacturer Part Number 2: RC0603FR-1010KL; Supplier 2: Digi-Key; Supplier Part Number 2: 13-RC0603FR-1010KLCT-ND; Manufacturer 3: UNI-ROYAL(Uniroyal Elec); Manufacturer Part Number 3: 0603WAF1002T5E; Supplier 3: LCSC; Supplier Part Number 3: C25804; JLC Type: Basic
R81 R83 R91 R95 = 100K/0603: as R186 on sheet Measurement; Part Number: 100K/0603; Package: 0603; Value: 100K; HelpURL: https://www.yageogroup.com/content/datasheet/asset/file/PYU-RC_GROUP_51_ROHS_L; Supplier 1: Digi-Key; Supplier Part Number 1: 13-RC0603FR-13100KLCT-ND; Manufacturer 2: YAGEO; Manufacturer Part Number 2: RC0603FR-10100KL; Supplier 2: Digi-Key; Supplier Part Number 2: 13-RC0603FR-10100KLCT-ND; Manufacturer 3: UNI-ROYAL(Uniroyal Elec); Manufacturer Part Number 3: 0603WAF1003T5E; Supplier 3: LCSC; Supplier Part Number 3: C25803; JLC Type: Basic
R82 = 2K4/0603: RES SM 0603 2K4; Manufacturer: GENERIC; Manufacturer 1: YAGEO; Manufacturer Part Number 1: RC0603FR-132K4L; Absolute Value: 2400; Eurocircuits GPN: GPR06032K4; Part Number: 2K4/0603; Package: 0603; Value: 2K4; HelpURL: https://www.yageogroup.com/content/datasheet/asset/file/PYU-RC_GROUP_51_ROHS_L; Supplier 1: Digi-Key; Supplier Part Number 1: 13-RC0603FR-132K4LCT-ND; Manufacturer 2: YAGEO; Manufacturer Part Number 2: RC0603FR-102K4L; Supplier 2: Digi-Key; Supplier Part Number 2: 13-RC0603FR-102K4LCT-ND
R84 = 6K8/0603: RES SM 0603 6K8; Manufacturer: GENERIC; Manufacturer 1: YAGEO; Manufacturer Part Number 1: RC0603FR-136K8L; Absolute Value: 6800; Eurocircuits GPN: GPR06036K8; Part Number: 6K8/0603; Package: 0603; Value: 6K8; HelpURL: https://www.yageogroup.com/content/datasheet/asset/file/PYU-RC_GROUP_51_ROHS_L; Supplier 1: Digi-Key; Supplier Part Number 1: 13-RC0603FR-136K8LCT-ND; Manufacturer 2: YAGEO; Manufacturer Part Number 2: RC0603FR-106K8L; Supplier 2: Digi-Key; Supplier Part Number 2: 13-RC0603FR-106K8LCT-ND; JLC Type: Basic; Manufacturer 3: UNI-ROYAL; Manufacturer Part Number 3: 0603WAF6801T5E; Supplier 3: LCSC; Supplier Part Number 3: C23212
R85 R90 = 200K/0603: RES SM 0603 200K; Manufacturer: GENERIC; Manufacturer 1: YAGEO; Manufacturer Part Number 1: RC0603FR-13200KL; Absolute Value: 200000; Eurocircuits GPN: GPR0603200K; Part Number: 200K/0603; Package: 0603; Value: 200K; HelpURL: https://www.yageogroup.com/content/datasheet/asset/file/PYU-RC_GROUP_51_ROHS_L; Supplier 1: Digi-Key; Supplier Part Number 1: 13-RC0603FR-13200KLCT-ND; Manufacturer 2: YAGEO; Manufacturer Part Number 2: RC0603FR-10200KL; Supplier 2: Digi-Key; Supplier Part Number 2: 13-RC0603FR-10200KLCT-ND; JLC Type: Basic; Manufacturer 3: UNI-ROYAL(Uniroyal Elec); Manufacturer Part Number 3: 0603WAF2003T5E; Supplier 3: LCSC; Supplier Part Number 3: C25811
R87 R88 R94 = 1K/0603: as R168 on sheet Measurement; Part Number: 1K/0603; Package: 0603; Value: 1K; HelpURL: https://www.yageogroup.com/content/datasheet/asset/file/PYU-RC_GROUP_51_ROHS_L; Supplier 1: Digi-Key; Supplier Part Number 1: 13-RC0603FR-131KLCT-ND; Manufacturer 2: YAGEO; Manufacturer Part Number 2: RC0603FR-101KL; Supplier 2: Digi-Key; Supplier Part Number 2: 13-RC0603FR-101KLCT-ND; Manufacturer 3: UNI-ROYAL(Uniroyal Elec); Manufacturer Part Number 3: 0603WAF1001T5E; Supplier 3: LCSC; Supplier Part Number 3: C21190; JLC Type: Basic
R89 = 1M/0603: as R184 on sheet Measurement; Part Number: 1M/0603; Package: 0603; Value: 1M; HelpURL: https://www.yageogroup.com/content/datasheet/asset/file/PYU-RC_GROUP_51_ROHS_L; Supplier 1: Digi-Key; Supplier Part Number 1: 13-RC0603FR-131MLCT-ND; Manufacturer 2: YAGEO; Manufacturer Part Number 2: RC0603FR-101ML; Supplier 2: Digi-Key; Supplier Part Number 2: 13-RC0603FR-101MLCT-ND; Manufacturer 3: UNI-ROYAL(Uniroyal Elec); Manufacturer Part Number 3: 0603WAF1004T5E; Supplier 3: LCSC; Supplier Part Number 3: C22935; JLC Type: Basic
R92 = 0R005/2512: RES SM 2512 0R005; Manufacturer: GENERIC; Manufacturer 1: Ohmite; Manufacturer Part Number 1: MCS3264R005FER; Absolute Value: 0.005; Part Number: 0R005/2512; Package: 2512; Value: 0R005; HelpURL: https://www.ohmite.com/assets/docs/res_mcs.pdf?r=false; Supplier 1: Digi-Key; Supplier Part Number 1: MCS3264R005FERCT-ND; Manufacturer 3: prosemi; Manufacturer Part Number 3: LMP25MF2P0R005; Supplier 3: LCSC; Supplier Part Number 3: C2937402
R93 = 2K/0603: RES SM 0603 2K; Manufacturer: GENERIC; Manufacturer 1: YAGEO; Manufacturer Part Number 1: RC0603FR-132KL; Absolute Value: 2000; Eurocircuits GPN: GPR06032K; Part Number: 2K/0603; Package: 0603; Value: 2K; HelpURL: https://www.yageogroup.com/content/datasheet/asset/file/PYU-RC_GROUP_51_ROHS_L; Supplier 1: Digi-Key; Supplier Part Number 1: 13-RC0603FR-132KLCT-ND; Manufacturer 2: YAGEO; Manufacturer Part Number 2: RC0603FR-102KL; Supplier 2: Digi-Key; Supplier Part Number 2: 13-RC0603FR-102KLCT-ND; Manufacturer 3: UNI-ROYAL(Uniroyal Elec); Manufacturer Part Number 3: 0603WAF2001T5E; Supplier 3: LCSC; Supplier Part Number 3: C22975; JLC Type: Basic
U8 = TLV314 SOT23: as U17 on sheet Measurement; Part Number: TLV314 SOT23; Package: SOT23-5; HelpURL: https://www.ti.com/lit/ds/symlink/tlv4314.pdf; Manufacturer 1: Texas Instruments; Supplier 1: Digi-Key; Supplier Part Number 1: 296-46275-1-ND; Manufacturer 3: Texas Instruments; Manufacturer Part Number 3: TLV314IDBVR; Supplier 3: LCSC; Supplier Part Number 3: C133032; Manufacturer 2: Texas Instruments; Manufacturer Part Number 2: TLV314IDBVT; Supplier 2: Digi-Key; Supplier Part Number 2: 296-44110-2-ND
U9 = TLV1701 SOT23: TLV1701 2.2-V to 36-V, microPower Comparato; Manufacturer: Texas Instruments; Manufacturer Part Number 1: TLV1701AIDBVR; Part Number: TLV1701 SOT23; Package: SOT23-5; HelpURL: https://www.ti.com/lit/ds/symlink/tlv1701.pdf; Manufacturer 1: Texas Instruments; Supplier 1: Digi-Key; Supplier Part Number 1: 296-40599-1-ND; Manufacturer 2: Texas Instruments; Manufacturer Part Number 2: TLV1701QDBVRQ1; Supplier 2: Digi-Key; Supplier Part Number 2: 296-47458-1-ND; Manufacturer 3: Texas Instruments; Manufacturer Part Number 3: TLV1701AIDBVR; Supplier 3: LCSC; Supplier Part Number 3: C130035

## Sheet Peripherals.SchDoc: Microcontroller Peripherals
size A3; DocumentNumber: 14; SheetNumber: 14; SheetTotal: 20
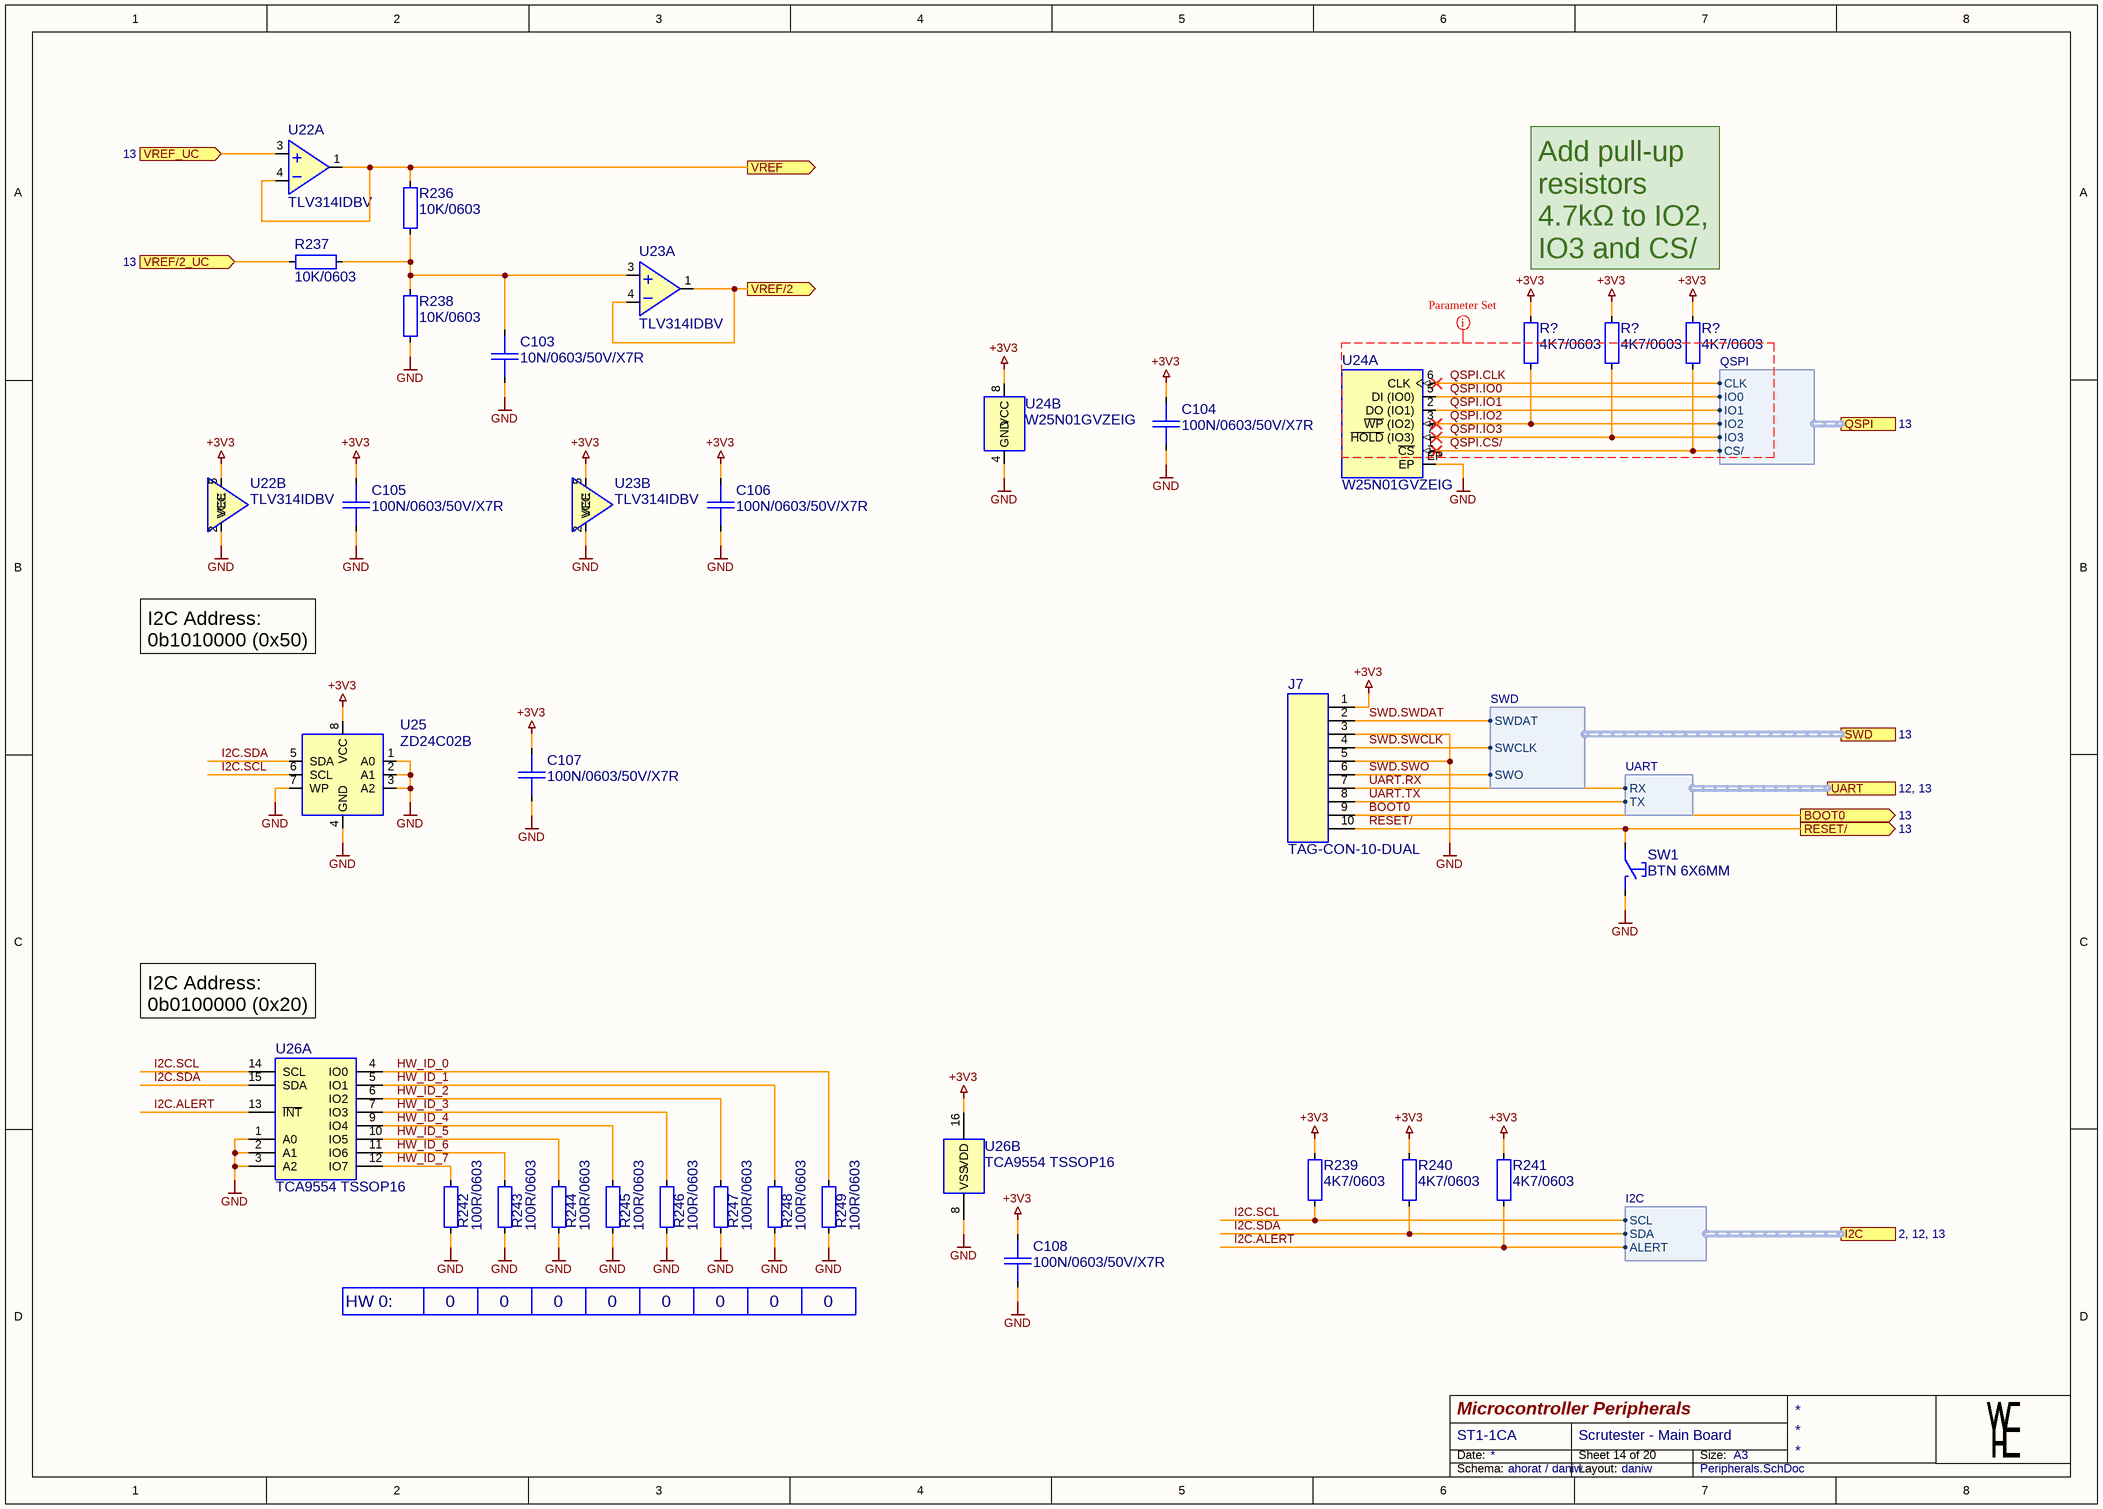
[diagram p10: Peripherals.SchDoc]

### Parts
(Parts that share a designator on the sheet are numbered #1, #2 ... from top to bottom, then left to right.)
C103  10N/0603/50V/X7R  [CAP0603_X7R]
C104  100N/0603/50V/X7R  [CAP0603_X7R]
C105  100N/0603/50V/X7R  [CAP0603_X7R]
C106  100N/0603/50V/X7R  [CAP0603_X7R]
C107  100N/0603/50V/X7R  [CAP0603_X7R]
C108  100N/0603/50V/X7R  [CAP0603_X7R]
J7  TAG-CON-10-DUAL  [TC2050-2]
R236  10K/0603  [R0603-0.40-WW]
R237  10K/0603  [R0603-0.40-WW]
R238  10K/0603  [R0603-0.40-WW]
R239  4K7/0603  [R0603-0.40-WW]
R240  4K7/0603  [R0603-0.40-WW]
R241  4K7/0603  [R0603-0.40-WW]
R242  100R/0603  [R0603-0.40-WW]
R243  100R/0603  [R0603-0.40-WW]
R244  100R/0603  [R0603-0.40-WW]
R245  100R/0603  [R0603-0.40-WW]
R246  100R/0603  [R0603-0.40-WW]
R247  100R/0603  [R0603-0.40-WW]
R248  100R/0603  [R0603-0.40-WW]
R249  100R/0603  [R0603-0.40-WW]
R?#29  4K7/0603  [R0603-0.40-WW]
R?#30  4K7/0603  [R0603-0.40-WW]
R?#31  4K7/0603  [R0603-0.40-WW]
SW1  BTN 6X6MM  [BTN-6X6MM-4.3MM-YELLOW]
U22  TLV314IDBV  [SOT2395P280X125-5-NW]  (parts A,B of 2)
U23  TLV314IDBV  [SOT2395P280X125-5-NW]  (parts A,B of 2)
U24  W25N01GVZEIG  [SON127P800X600X080-8-EP340X430]  (parts A,B of 2)
U25  ZD24C02B  [SOP127P600X155-8-SW]
U26  TCA9554 TSSOP16  [SOP065P640X110-16NW]  (parts A,B of 2)

### Ports
BOOT0 (out, see 13), I2C (harness I2C, see 2, 12, 13), QSPI (harness QSPI, see 13), RESET/ (out, see 13), SWD (harness SWD, see 13), UART (harness UART, see 12, 13), VREF (out), VREF/2 (out), VREF/2_UC (in, see 13), VREF_UC (in, see 13)

### Harnesses
I2C: ALERT, SCL, SDA
QSPI: CLK, IO0, CS/, IO1, IO2, IO3
UART: TX, RX
SWD: SWDAT, SWCLK, SWO

### Nets
+3V3: C104.1 C105.1 C106.1 C107.1 C108.1 J7.1 R239.1 R240.1 R241.1 R?#29.1 R?#30.1 R?#31.1 U22.5(VCC) U23.5(VCC) U24.8(VCC) U25.8(VCC) U26.16(VDD)
GND: C103.2 C104.2 C105.2 C106.2 C107.2 C108.2 J7.3 J7.5 R238.2 R242.2 R243.2 R244.2 R245.2 R246.2 R247.2 R248.2 R249.2 SW1.2(NO) U22.2(VEE) U23.2(VEE) U24.4(GND) U24.EP U25.1(A0) U25.2(A1) U25.3(A2) U25.4(GND) U25.7(WP) U26.1(A0) U26.2(A1) U26.3(A2) U26.8(VSS)
VREF: R236.1 U22.1(OUT) U22.4(IN-) ; port VREF
VREF/2: U23.1(OUT) U23.4(IN-) ; port VREF/2
BOOT0: J7.9 ; port BOOT0
HW_ID_0: R249.1 U26.4(IO0)
HW_ID_1: R248.1 U26.5(IO1)
HW_ID_2: R247.1 U26.6(IO2)
HW_ID_3: R246.1 U26.7(IO3)
HW_ID_4: R245.1 U26.9(IO4)
HW_ID_5: R244.1 U26.10(IO5)
HW_ID_6: R243.1 U26.11(IO6)
HW_ID_7: R242.1 U26.12(IO7)
I2C.ALERT: R241.2 U26.13(~{INT}) ; port I2C.ALERT
I2C.SCL: R239.2 U25.6(SCL) U26.14(SCL) ; port I2C.SCL
I2C.SDA: R240.2 U25.5(SDA) U26.15(SDA) ; port I2C.SDA
QSPI.CLK: U24.6(CLK) ; port QSPI.CLK
QSPI.CS/: R?#31.2 U24.1(~{CS}) ; port QSPI.CS/
QSPI.IO0: U24.5(DI_(IO0)) ; port QSPI.IO0
QSPI.IO1: U24.2(DO_(IO1)) ; port QSPI.IO1
QSPI.IO2: R?#29.2 U24.3(~{WP}_(IO2)) ; port QSPI.IO2
QSPI.IO3: R?#30.2 U24.7(~{HOLD}_(IO3)) ; port QSPI.IO3
RESET/: J7.10 SW1.1(COM) ; port RESET/
SWD.SWCLK: J7.4 ; port SWD.SWCLK
SWD.SWDAT: J7.2 ; port SWD.SWDAT
SWD.SWO: J7.6 ; port SWD.SWO
UART.RX: J7.7 ; port UART.RX
UART.TX: J7.8 ; port UART.TX
VREF/2_UC: R237.1 ; port VREF/2_UC
VREF_UC: U22.3(IN+) ; port VREF_UC
NetC103_1: C103.1 R236.2 R237.2 R238.1 U23.3(IN+)

### Layout directives
net class QSPI: QSPI.CLK, QSPI.CS/, QSPI.IO0, QSPI.IO1, QSPI.IO2, QSPI.IO3

### Notes on the sheet
- Add pull-up resistors 4.7kΩ to IO2, IO3 and CS/
- I2C Address:
  0b1010000 (0x50)
- I2C Address:
  0b0100000 (0x20)
- HW 0:
- 0
- Date:
- Size:
- A3
- Schema:
- Layout:

### Library data of the parts
C103 = 10N/0603/50V/X7R: as C74 on sheet Measurement; Part Number: 10N/0603/50V/X7R; Package: 0603; Value: 10nF; HelpURL: https://www.yageo.com/upload/media/product/app/datasheet/mlcc/upy-gphc_x7r_6_3v-to-250v.pdf; Supplier 1: Digi-Key; Supplier Part Number 1: 311-1572-1-ND; Manufacturer 2: YAGEO; Manufacturer Part Number 2: CC0603KRX7R9BB103; Supplier 2: Digi-Key; Supplier Part Number 2: 311-1085-1-ND; Manufacturer Part Number 3: CC0603KRX7R9BB103; Supplier 3: LCSC; Supplier Part Number 3: C100042
C104-C108 = 100N/0603/50V/X7R: as C72 on sheet Measurement; Part Number: 100N/0603/50V/X7R; Package: 0603; Value: 100nF; HelpURL: https://www.yageo.com/upload/media/product/app/datasheet/mlcc/upy-gphc_x7r_6_3v-to-250v.pdf; Supplier 1: Digi-Key; Supplier Part Number 1: 311-3567-1-ND; Supplier 3: LCSC; Supplier Part Number 3: C14663; Manufacturer 2: YAGEO; Manufacturer Part Number 2: CC0603MRX7R9BB104; Supplier 2: Digi-Key; Supplier Part Number 2: 311-4110-1-ND; JLC Type: Basic; Manufacturer Part Number 3: CC0603KRX7R9BB104
J7 = TAG-CON-10-DUAL: Tag-Connect 2050, 10 pins, two-sided; Part Number: TAG-CON-10-DUAL; Manufacturer: TAG-CONNECT; HelpURL: https://www.tag-connect.com/wp-content/uploads/bsk-pdf-manager/TC2050-IDC_Datasheet_7.pdf
R236-R238 = 10K/0603: as R80 on sheet Overvoltage_Protection; Part Number: 10K/0603; Package: 0603; Value: 10K; HelpURL: https://www.yageogroup.com/content/datasheet/asset/file/PYU-RC_GROUP_51_ROHS_L; Supplier 1: Digi-Key; Supplier Part Number 1: 13-RC0603FR-1310KLCT-ND; Manufacturer 2: YAGEO; Manufacturer Part Number 2: RC0603FR-1010KL; Supplier 2: Digi-Key; Supplier Part Number 2: 13-RC0603FR-1010KLCT-ND; Manufacturer 3: UNI-ROYAL(Uniroyal Elec); Manufacturer Part Number 3: 0603WAF1002T5E; Supplier 3: LCSC; Supplier Part Number 3: C25804; JLC Type: Basic
R239-R241 R?#29-R?#31 = 4K7/0603: RES SM 0603 4K7; Manufacturer: GENERIC; Manufacturer 1: YAGEO; Manufacturer Part Number 1: RC0603FR-134K7L; Absolute Value: 4700; Eurocircuits GPN: GPR06034K7; Part Number: 4K7/0603; Package: 0603; Value: 4K7; HelpURL: https://www.yageogroup.com/content/datasheet/asset/file/PYU-RC_GROUP_51_ROHS_L; Supplier 1: Digi-Key; Supplier Part Number 1: 13-RC0603FR-134K7LCT-ND; Manufacturer 2: YAGEO; Manufacturer Part Number 2: RC0603FR-104K7L; Supplier 2: Digi-Key; Supplier Part Number 2: 13-RC0603FR-104K7LCT-ND; Manufacturer 3: UNI-ROYAL(Uniroyal Elec); Manufacturer Part Number 3: 0603WAF4701T5E; Supplier 3: LCSC; Supplier Part Number 3: C23162; JLC Type: Basic
R242-R249 = 100R/0603: RES SM 0603 100R; Manufacturer: GENERIC; Manufacturer 1: YAGEO; Manufacturer Part Number 1: RC0603FR-13100RL; Absolute Value: 100; Eurocircuits GPN: GPR0603100R; Part Number: 100R/0603; Package: 0603; Value: 100R; HelpURL: https://www.yageogroup.com/content/datasheet/asset/file/PYU-RC_GROUP_51_ROHS_L; Supplier 1: Digi-Key; Supplier Part Number 1: 13-RC0603FR-13100RLCT-ND; Manufacturer 2: YAGEO; Manufacturer Part Number 2: RC0603FR-10100RL; Supplier 2: Digi-Key; Supplier Part Number 2: 13-RC0603FR-10100RLCT-ND; Manufacturer 3: UNI-ROYAL(Uniroyal Elec); Manufacturer Part Number 3: 0603WAF1000T5E; Supplier 3: LCSC; Supplier Part Number 3: C22775
SW1 = BTN 6X6MM 4.3MM 1.5N: Pushbutton switch, PCB mount, 6x6mm, 4.3mm height, 1.5N operating force; Manufacturer 1: Omron Electronics Inc-EMC Div; Manufacturer Part Number 1: B3F-1002; Part Number: BTN 6X6MM 4.3MM 1.5N; HelpURL: https://omronfs.omron.com/en_US/ecb/products/pdf/en-b3f.pdf; Supplier 1: Digi-Key; Supplier Part Number 1: SW401-ND
U22 U23 = TLV314 SOT23: as U17 on sheet Measurement; Part Number: TLV314 SOT23; Package: SOT23-5; HelpURL: https://www.ti.com/lit/ds/symlink/tlv4314.pdf; Manufacturer 1: Texas Instruments; Supplier 1: Digi-Key; Supplier Part Number 1: 296-46275-1-ND; Manufacturer 3: Texas Instruments; Manufacturer Part Number 3: TLV314IDBVR; Supplier 3: LCSC; Supplier Part Number 3: C133032; Manufacturer 2: Texas Instruments; Manufacturer Part Number 2: TLV314IDBVT; Supplier 2: Digi-Key; Supplier Part Number 2: 296-44110-2-ND
U24 = W25N01GVZEIG: W25N01GVZEIG 3V 1G-BIT Serial SLC NAND Flash Memoryw with Dual/Quad SPI Buffer Read & Continuous Read; Manufacturer: Winbond; Manufacturer 1: Winbond Electronics; Manufacturer Part Number 1: W25N01GVZEIG TR; Part Number: W25N01GVZEIG; Package: DFN-8; HelpURL: https://www.winbond.com/resource-files/W25N01GV%20Rev%20O%20092619.pdf; Supplier 1: Digi-Key; Supplier Part Number 1: 256-W25N01GVZEIGTRCT-ND; Manufacturer 2: Winbond Electronics; Manufacturer Part Number 2: W25N01GVZEIG; Supplier 2: Digi-Key; Supplier Part Number 2: 256-W25N01GVZEIG-ND; Manufacturer 3: Winbond; Manufacturer Part Number 3: W25N01GVZEIG; Supplier 3: LCSC; Supplier Part Number 3: C907680; JLC Type: Extended
U25 = ZD24C02B: I2C-Compatible (2-wire) Serial EEPROM 2K bits; Manufacturer: Zetta; Part Number: ZD24C02B; Package: SOIC-8; HelpURL: https://datasheet.lcsc.com/lcsc/2402020955_Zetta-ZD24C02B-SSGMB_C5374786.pdf; Manufacturer 3: Zetta; Manufacturer Part Number 3: ZD24C02B-SSGMB; Supplier 3: LCSC; Supplier Part Number 3: C5374786; JLC Type: Extended
U26 = TCA9554 TSSOP16: TCA9554 Low Voltage 8-Bit I2C and SMBus Low-Power I/O Expander With Interrupt Output and Configuration Registers; Manufacturer: Texas Instruments; Manufacturer Part Number 1: TCA9554PWR; Part Number: TCA9554 TSSOP16; Package: TSSOP-16; HelpURL: https://www.ti.com/lit/ds/symlink/tca9554.pdf; Manufacturer 1: Texas Instruments; Supplier 1: Digi-Key; Supplier Part Number 1: 296-30135-1-ND; Manufacturer 3: TI; Manufacturer Part Number 3: TCA9554PWR; Supplier 3: LCSC; Supplier Part Number 3: C477924

## Sheet Overcurrent_Protection.SchDoc: Overcurrent Protection
size A3; DocumentNumber: 8; SheetNumber: 8; SheetTotal: 20
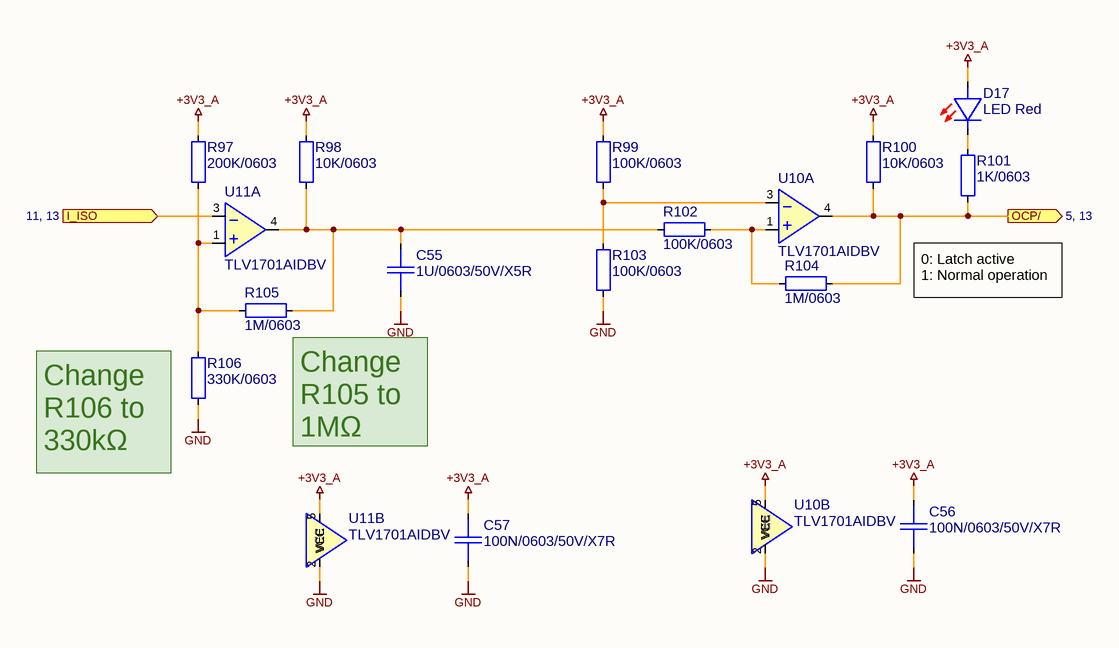
[diagram p11: Overcurrent_Protection.SchDoc]

### Parts
C55  1U/0603/50V/X5R  [CAP0603_X7R]
C56  100N/0603/50V/X7R  [CAP0603_X7R]
C57  100N/0603/50V/X7R  [CAP0603_X7R]
D17  LED Red  [LED0805_RED]
R97  200K/0603  [R0603-0.40-WW]
R98  10K/0603  [R0603-0.40-WW]
R99  100K/0603  [R0603-0.40-WW]
R100  10K/0603  [R0603-0.40-WW]
R101  1K/0603  [R0603-0.40-WW]
R102  100K/0603  [R0603-0.40-WW]
R103  100K/0603  [R0603-0.40-WW]
R104  1M/0603  [R0603-0.40-WW]
R105  1M/0603  [R0603-0.40-WW]
R106  330K/0603  [R0603-0.40-WW]
U10  TLV1701AIDBV  [SOT2395P280X125-5-NW]  (parts A,B of 2)
U11  TLV1701AIDBV  [SOT2395P280X125-5-NW]  (parts A,B of 2)

### Ports
I_ISO (in, see 11, 13), OCP/ (out, see 5, 13)

### Nets
+3V3_A: C56.1 C57.1 D17.2(A) R97.1 R98.2 R99.2 R100.2 U10.5(VCC) U11.5(VCC)
GND: C55.2 C56.2 C57.2 R103.2 R106.2 U10.2(VEE) U11.2(VEE)
I_ISO: U11.3(IN-) ; port I_ISO
OCP/: R100.1 R101.1 R104.2 U10.4(OUT) ; port OCP/
NetC55_1: C55.1 R98.1 R102.1 R105.2 U11.4(OUT)
NetD17_1: D17.1(C) R101.2
NetR97_2: R97.2 R105.1 R106.1 U11.1(IN+)
NetR99_1: R99.1 R103.1 U10.3(IN-)
NetR102_2: R102.2 R104.1 U10.1(IN+)

### Notes on the sheet
- 0: Latch active
  1: Normal operation
- (near R105) Change R105 to 1MΩ
- (near R106) Change R106 to 330kΩ
- Date:
- Size:
- A3
- Schema:
- Layout:

### Library data of the parts
C55 = 1U/0603/50V/X5R: CAP SM 0603 1.0uF 50V X5R; Manufacturer: GENERIC; Manufacturer 1: Samsung Electro-Mechanics; Manufacturer Part Number 1: CL10A105KB8NNNC; Absolute Value: 1E-6; Eurocircuits GPN: GPC0603105-X5R; Part Number: 1U/0603/50V/X5R; Package: 0603; Value: 1.0uF; HelpURL: https://mm.digikey.com/Volume0/opasdata/d220001/medias/docus/658/CL10A105KB8NNNC_Spec.pdf; Supplier 1: Digi-Key; Supplier Part Number 1: 1276-1860-1-ND; Manufacturer Part Number 3: CL10A105KB8NNNC; Supplier 3: LCSC; Supplier Part Number 3: C15849; JLC Type: Basic
C56 C57 = 100N/0603/50V/X7R: as C72 on sheet Measurement; Part Number: 100N/0603/50V/X7R; Package: 0603; Value: 100nF; HelpURL: https://www.yageo.com/upload/media/product/app/datasheet/mlcc/upy-gphc_x7r_6_3v-to-250v.pdf; Supplier 1: Digi-Key; Supplier Part Number 1: 311-3567-1-ND; Supplier 3: LCSC; Supplier Part Number 3: C14663; Manufacturer 2: YAGEO; Manufacturer Part Number 2: CC0603MRX7R9BB104; Supplier 2: Digi-Key; Supplier Part Number 2: 311-4110-1-ND; JLC Type: Basic; Manufacturer Part Number 3: CC0603KRX7R9BB104
D17 = LED Red 0805: as D12 on sheet Overvoltage_Protection; Part Number: LED Red 0805; Manufacturer: GENERIC; Package: 805; Value: Red; Absolute Value: Red; HelpURL: https://www.we-online.com/katalog/datasheet/150060RS75000.pdf; Supplier 1: Digikey; Supplier Part Number 1: 732-4984-1-ND; Manufacturer 3: Foshan NationStar Optoelectronics; Manufacturer Part Number 3: NCD0805R1; Supplier 3: LCSC; Supplier Part Number 3: C84256; JLC Type: Basic
R97 = 200K/0603: as R85 on sheet Overvoltage_Protection; Part Number: 200K/0603; Package: 0603; Value: 200K; HelpURL: https://www.yageogroup.com/content/datasheet/asset/file/PYU-RC_GROUP_51_ROHS_L; Supplier 1: Digi-Key; Supplier Part Number 1: 13-RC0603FR-13200KLCT-ND; Manufacturer 2: YAGEO; Manufacturer Part Number 2: RC0603FR-10200KL; Supplier 2: Digi-Key; Supplier Part Number 2: 13-RC0603FR-10200KLCT-ND; Manufacturer 3: UNI-ROYAL(Uniroyal Elec); Manufacturer Part Number 3: 0603WAF2003T5E; Supplier 3: LCSC; Supplier Part Number 3: C25811; JLC Type: Basic
R98 R100 = 10K/0603: as R80 on sheet Overvoltage_Protection; Part Number: 10K/0603; Package: 0603; Value: 10K; HelpURL: https://www.yageogroup.com/content/datasheet/asset/file/PYU-RC_GROUP_51_ROHS_L; Supplier 1: Digi-Key; Supplier Part Number 1: 13-RC0603FR-1310KLCT-ND; Manufacturer 2: YAGEO; Manufacturer Part Number 2: RC0603FR-1010KL; Supplier 2: Digi-Key; Supplier Part Number 2: 13-RC0603FR-1010KLCT-ND; Manufacturer 3: UNI-ROYAL(Uniroyal Elec); Manufacturer Part Number 3: 0603WAF1002T5E; Supplier 3: LCSC; Supplier Part Number 3: C25804; JLC Type: Basic
R99 R102 R103 = 100K/0603: as R186 on sheet Measurement; Part Number: 100K/0603; Package: 0603; Value: 100K; HelpURL: https://www.yageogroup.com/content/datasheet/asset/file/PYU-RC_GROUP_51_ROHS_L; Supplier 1: Digi-Key; Supplier Part Number 1: 13-RC0603FR-13100KLCT-ND; Manufacturer 2: YAGEO; Manufacturer Part Number 2: RC0603FR-10100KL; Supplier 2: Digi-Key; Supplier Part Number 2: 13-RC0603FR-10100KLCT-ND; Manufacturer 3: UNI-ROYAL(Uniroyal Elec); Manufacturer Part Number 3: 0603WAF1003T5E; Supplier 3: LCSC; Supplier Part Number 3: C25803; JLC Type: Basic
R101 = 1K/0603: as R168 on sheet Measurement; Part Number: 1K/0603; Package: 0603; Value: 1K; HelpURL: https://www.yageogroup.com/content/datasheet/asset/file/PYU-RC_GROUP_51_ROHS_L; Supplier 1: Digi-Key; Supplier Part Number 1: 13-RC0603FR-131KLCT-ND; Manufacturer 2: YAGEO; Manufacturer Part Number 2: RC0603FR-101KL; Supplier 2: Digi-Key; Supplier Part Number 2: 13-RC0603FR-101KLCT-ND; Manufacturer 3: UNI-ROYAL(Uniroyal Elec); Manufacturer Part Number 3: 0603WAF1001T5E; Supplier 3: LCSC; Supplier Part Number 3: C21190; JLC Type: Basic
R104 R105 = 1M/0603: as R184 on sheet Measurement; Part Number: 1M/0603; Package: 0603; Value: 1M; HelpURL: https://www.yageogroup.com/content/datasheet/asset/file/PYU-RC_GROUP_51_ROHS_L; Supplier 1: Digi-Key; Supplier Part Number 1: 13-RC0603FR-131MLCT-ND; Manufacturer 2: YAGEO; Manufacturer Part Number 2: RC0603FR-101ML; Supplier 2: Digi-Key; Supplier Part Number 2: 13-RC0603FR-101MLCT-ND; Manufacturer 3: UNI-ROYAL(Uniroyal Elec); Manufacturer Part Number 3: 0603WAF1004T5E; Supplier 3: LCSC; Supplier Part Number 3: C22935; JLC Type: Basic
R106 = 330K/0603: RES SM 0603 330K; Manufacturer: GENERIC; Manufacturer 1: YAGEO; Manufacturer Part Number 1: RC0603FR-13330KL; Absolute Value: 330000; Eurocircuits GPN: GPR0603330K; Part Number: 330K/0603; Package: 0603; Value: 330K; HelpURL: https://www.yageogroup.com/content/datasheet/asset/file/PYU-RC_GROUP_51_ROHS_L; Supplier 1: Digi-Key; Supplier Part Number 1: 13-RC0603FR-13330KLCT-ND; Manufacturer 2: YAGEO; Manufacturer Part Number 2: RC0603FR-10330KL; Supplier 2: Digi-Key; Supplier Part Number 2: 13-RC0603FR-10330KLCT-ND; Manufacturer 3: YAGEO; Manufacturer Part Number 3: RC0603FR-07330KL; Supplier 3: LCSC; Supplier Part Number 3: C114618; JLC Type: Basic
U10 U11 = TLV1701 SOT23: as U9 on sheet Overvoltage_Protection; Part Number: TLV1701 SOT23; Package: SOT23-5; HelpURL: https://www.ti.com/lit/ds/symlink/tlv1701.pdf; Manufacturer 1: Texas Instruments; Supplier 1: Digi-Key; Supplier Part Number 1: 296-40599-1-ND; Manufacturer 2: Texas Instruments; Manufacturer Part Number 2: TLV1701QDBVRQ1; Supplier 2: Digi-Key; Supplier Part Number 2: 296-47458-1-ND; Manufacturer 3: Texas Instruments; Manufacturer Part Number 3: TLV1701AIDBVR; Supplier 3: LCSC; Supplier Part Number 3: C130035